# Altium schematic sheet [SH][SW1] V1.0.SchDoc
size A3; PageSetup: Record=PageOptions|CenterHorizontal=True|CenterVertical=True|PrintScale=0.91|XCorrection=1.00|YCorrection=1.00|PrintKind=1|BorderSize=5000000|LeftOffset=0|BottomOffset=0|Orientation=2|PaperLength=3530|PaperWidth=2500|Scale=100|PaperSource=7|PrintQuality=1200|MediaType=1|DitherType=10|PrintScaleMode=1|PaperKind=B4 (ISO)|PaperIndex=42
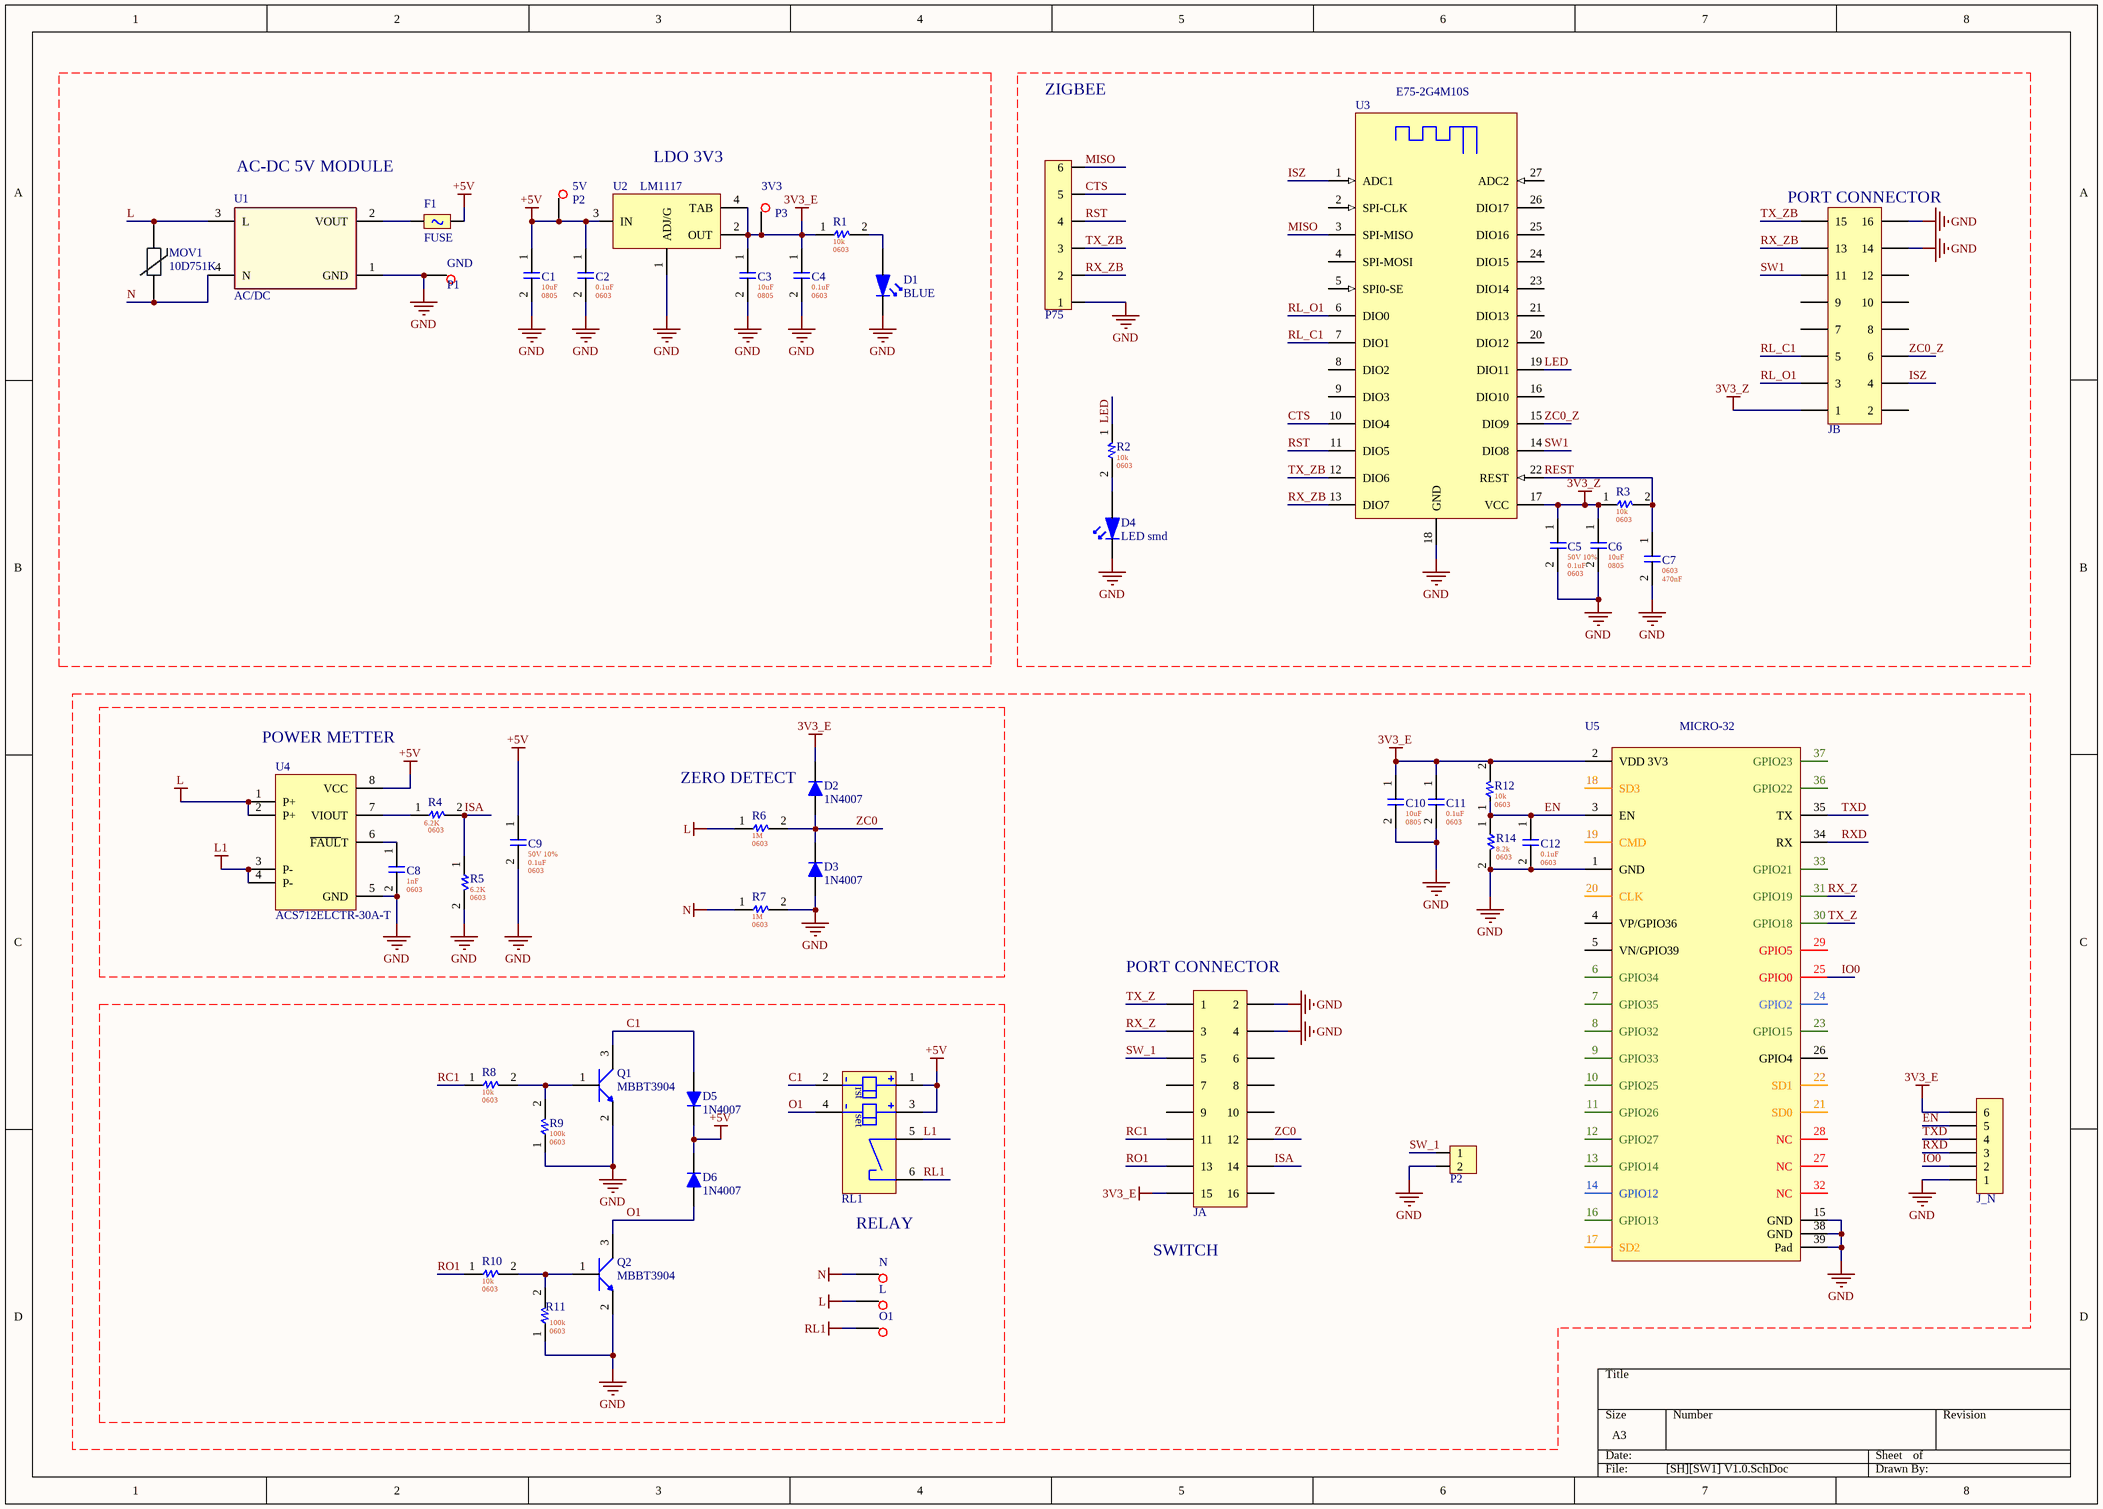
[diagram p0: [SH][SW1] V1.0.SchDoc]

## Parts
3V3  P3  [TEXT_POINT]
5V  P2  [TEXT_POINT]
C1  FP: 0805  [0805 C]  (hidden comment: 10uF)
C2  FP: 0603  [0603 C]  (hidden comment: 0.1uF)
C3  FP: 0805  [0805 C]  (hidden comment: 10uF)
C4  FP: 0603  [0603 C]  (hidden comment: 0.1uF)
C5  VOLTAGE + TOLE: 50V 10%  FP: 0603  [0603 C]  (hidden comment: 0.1uF)
C6  FP: 0805  [0805 C]  (hidden comment: 10uF)
C7  FP: 0603  [0603 C]  (hidden comment: 470nF)
C8  FP: 0603  [0603 C]  (hidden comment: 1nF)
C9  VOLTAGE + TOLE: 50V 10%  FP: 0603  [0603 C]  (hidden comment: 0.1uF)
C10  FP: 0805  [0805 C]  (hidden comment: 10uF)
C11  FP: 0603  [0603 C]  (hidden comment: 0.1uF)
C12  FP: 0603  [0603 C]  (hidden comment: 0.1uF)
D1  BLUE  [Led 1206]
D2  1N4007  [SOD-123]
D3  1N4007  [SOD-123]
D4  LED smd  [Led 1206]
D5  1N4007  [SOD-123]
D6  1N4007  [SOD-123]
F1  FUSE  [1812]
GND  P1  [TEXT_POINT]
J_N  P6  [P6 - 1.27MM]  (value not drawn)
JA  rao doi  [P2X8 - 2.0mm - female - SMD]  (value not drawn)
JB  rao doi  [P2X8 - 2.0mm - SMD]  (value not drawn)
L  P1  [P1 - BRASS TERMINAL]  (value not drawn)
MOV1  10D751K  [MOV]
N  P1  [P1 - BRASS TERMINAL]  (value not drawn)
O1  P1  [P1 - BRASS TERMINAL]  (value not drawn)
P2  P2  [P2 - 2.54mm]  (value not drawn)
P75  P6  [P6 - 1.27MM]  (value not drawn)
Q1  MBBT3904  [SOT 23-3]
Q2  MBBT3904  [SOT 23-3]
R1  FP: 0603  [0603 R]  (hidden comment: 10k)
R2  FP: 0603  [0603 R]  (hidden comment: 10k)
R3  FP: 0603  [0603 R]  (hidden comment: 10k)
R4  value 6.2K  FP: 0603  [0603 R]  (hidden comment: 8.2k)
R5  value 6.2K  FP: 0603  [0603 R]  (hidden comment: 8.2k)
R6  FP: 0603  [0603 R]  (hidden comment: 1M)
R7  FP: 0603  [0603 R]  (hidden comment: 1M)
R8  FP: 0603  [0603 R]  (hidden comment: 10K)
R9  FP: 0603  [0603 R]  (hidden comment: 100k)
R10  FP: 0603  [0603 R]  (hidden comment: 10K)
R11  FP: 0603  [0603 R]  (hidden comment: 100k)
R12  FP: 0603  [0603 R]  (hidden comment: 10k)
R14  FP: 0603  [0603 R]  (hidden comment: 8.2k)
RL1  RELAY CHOT  [HFE60]  (value not drawn)
U1  AC/DC  [AC-DC 5V K4H24]
U2  LM1117  [SOT23-4]
U3  E75-2G4M10S  [ebyte - E75-2G4M10S]
U4  ACS712ELCTR-30A-T  [SOIC 8]
U5  MICRO-32  [ESP MICRO 32]

## Nets
3V3_E: 3V3.1(P) C3.1 C4.1 C10.1 C11.1 D2.2 J_N.6 JA.15 R1.1 R12.2 U2.2(OUT) U2.4(TAB) U5.2(VDD_3V3)
3V3_Z: C5.1 C6.1 JB.1 R3.1 U3.17(VCC)
+5V: 5V.1(P) C1.1 C2.1 C9.1 D5.2 D6.2 F1.2 RL1.1 RL1.3 U2.3(IN) U4.8(VCC)
GND: C1.2 C2.2 C3.2 C4.2 C5.2 C6.2 C7.2 C8.2 C9.2 C10.2 C11.2 C12.2 D1.2 D3.1 D4.2 GND.1(P) J_N.1 JA.2 JA.4 JB.14 JB.16 P2.2 P75.1 Q1.2(E) Q2.2(E) R5.2 R7.2 R9.1 R11.1 R14.2 U1.1(GND) U2.1(ADJ/G) U3.18(GND) U4.5(GND) U5.1(GND) U5.15(GND) U5.38(GND) U5.39(Pad)
L: L.1(P) MOV1.2 R6.1 U1.3(L) U4.1(P+) U4.2(P+)
L1: RL1.5 U4.3(P-) U4.4(P-)
N: MOV1.1 N.1(P) R7.1 U1.4(N)
RL1: O1.1(P) RL1.6
C1: D5.1 Q1.3(C) RL1.2
CTS: P75.5 U3.10(DIO4)
EN: C12.1 J_N.5 R12.1 R14.1 U5.3(EN)
IO0: J_N.2 U5.25(GPIO0)
ISA: JA.14 R4.2 R5.1
ISZ: JB.4 U3.1(ADC1)
LED: R2.1 U3.19(DIO11)
MISO: P75.6 U3.3(SPI-MISO)
O1: D6.1 Q2.3(C) RL1.4
RC1: JA.11 R8.1
REST: C7.1 R3.2 U3.22(REST)
RL_C1: JB.5 U3.7(DIO1)
RL_O1: JB.3 U3.6(DIO0)
RO1: JA.13 R10.1
RST: P75.4 U3.11(DIO5)
RX_Z: JA.3 U5.31(GPIO19)
RX_ZB: JB.13 P75.2 U3.13(DIO7)
RXD: J_N.3 U5.34(RX)
SW1: JB.11 U3.14(DIO8)
SW_1: JA.5 P2.1
TX_Z: JA.1 U5.30(GPIO18)
TX_ZB: JB.15 P75.3 U3.12(DIO6)
TXD: J_N.4 U5.35(TX)
ZC0: D2.1 D3.2 JA.12 R6.2
ZC0_Z: JB.6 U3.15(DIO9)
NetC8_1: C8.1 U4.6(~{FAUL}T)
NetD1_1: D1.1 R1.2
NetD4_1: D4.1 R2.2
NetF1_1: F1.1 U1.2(VOUT)
NetQ1_1: Q1.1(B) R8.2 R9.2
NetQ2_1: Q2.1(B) R10.2 R11.2
NetR4_1: R4.1 U4.7(VIOUT)

Not connected (* = marked no-connect by the designer): JA 6 7 8 9 10 16; JB 2 7 8 9 10 12; U3 2(SPI-CLK) 4(SPI-MOSI) 5(SPI0-SE) 8(DIO2) 9(DIO3) 16(DIO10) 20(DIO12) 21(DIO13) 23(DIO14) 24(DIO15) 25(DIO16) 26(DIO17) 27(ADC2); U5 4(VP/GPIO36) 5(VN/GPIO39) 6(GPIO34) 7(GPIO35) 8(GPIO32) 9(GPIO33) 10(GPIO25) 11(GPIO26) 12(GPIO27) 13(GPIO14) 14(GPIO12) 16(GPIO13) 17(SD2) 18(SD3) 19(CMD) 20(CLK) 21(SD0) 22(SD1) 23(GPIO15) 24(GPIO2) 26(GPIO4) 27(NC) 28(NC) 29(GPIO5) 32(NC) 33(GPIO21) 36(GPIO22) 37(GPIO23)

## Notes on the sheet
- ZIGBEE
- (near U1) AC-DC 5V MODULE
- (near U2) LDO 3V3
- (near JB) PORT CONNECTOR
- (near U4) POWER METTER
- ZERO DETECT
- (near JA) PORT CONNECTOR
- RELAY
- (near JA) SWITCH
- (in symbol RELAY CHOT) rst; set

## Library data of the parts
3V3 5V = P1
C1 C3 C6 C10 = 0805 10uF CER: CAP CER 10uF 50V 10% 0805 SMD; VOLTAGE + TOLE: 50V 10%; PACKAGE: SMD; DATE: 04-Mar-21; CREATOR: MMUOP; ComponentLink1Description: New link; ComponentLink1URL: *; VALUE: 10uF
C2 C4 C11 C12 = 0603 0.1uF CER: CAP CER 0.1uF 50V 10% 0603 SMD; VOLTAGE + TOLE: 50V 10%; PACKAGE: SMD; DATE: 04-Mar-21; CREATOR: MMUOP; ComponentLink1Description: New link; ComponentLink1URL: *; VALUE: 0.1uF
C5 C9 = 0603 0.1uF CER: CAP CER 0.1uF 50V 10% 0603 SMD; PACKAGE: SMD; DATE: 04-Mar-21; CREATOR: MMUOP; ComponentLink1Description: New link; ComponentLink1URL: *; VALUE: 0.1uF
C7 = 0603 470nF CER: CAP CER 470nF 50V 10% 0603 SMD; VOLTAGE + TOLE: 50V 10%; PACKAGE: SMD; DATE: 04-Mar-21; CREATOR: MMUOP; ComponentLink1Description: New link; ComponentLink1URL: *; VALUE: 470nF
C8 = 0603 1nF CER: CAP CER 1nF 50V 10% 0603 SMD; VOLTAGE + TOLE: 50V 10%; PACKAGE: SMD; DATE: 04-Mar-21; CREATOR: MMUOP; ComponentLink1Description: New link; ComponentLink1URL: *; VALUE: 1nF
D1 = LED smd
D2 D3 D5 D6 = Diode schottky: PN: *
JA JB = P2x8
MOV1 = VARISTOR: 750V
Q1 Q2 = TRANS NPN: Bipolar (BJT) Transistor NPN 40 V 200 mA 300MHz 350 mW Surface Mount SOT-23-3 (TO-236)
R1-R3 R12 = 0603 10k 1%: 10k 1% 0603 SMD; PN: C98220; PACKAGE: SMD; DATE: 04-Mar-21; CREATOR: MMUOP; ComponentLink1Description: New link; ComponentLink1URL: *; VOLTAGE + TOLE: 1%; VALUE: 10k
R4 R5 R14 = 0603 8.2k 1%: 8.2k 1% 0603 SMD; PACKAGE: SMD; DATE: 04-Mar-21; CREATOR: MMUOP; ComponentLink1Description: New link; ComponentLink1URL: *; VOLTAGE + TOLE: 1%
  R14: VALUE: 8.2k
R6 R7 = 0603 1M 1%: 1M 1% 0603 SMD; PACKAGE: SMD; DATE: 04-Mar-21; CREATOR: MMUOP; ComponentLink1Description: New link; ComponentLink1URL: *; VOLTAGE + TOLE: 1%; VALUE: 1M
R8 R10 = 0603 10K 1%: 10k 1% 0603 SMD; PACKAGE: SMD; DATE: 04-Mar-21; CREATOR: MMUOP; ComponentLink1Description: New link; ComponentLink1URL: *; VOLTAGE + TOLE: 1%; VALUE: 10k
R9 R11 = 0603 100K 1%: 100k 1% 0603 SMD; PACKAGE: SMD; DATE: 04-Mar-21; CREATOR: MMUOP; ComponentLink1Description: New link; ComponentLink1URL: *; VOLTAGE + TOLE: 1%; VALUE: 100k
U3 = ebyte - E75-2G4M10S
U4 = ACS71240: ACS712ELCTR-20A  SOIC 8; ComponentLink1Description: New link; ComponentLink1URL: https://banlinhkiendientu.vn/acs712t/
U5 = ESP MICRO-32_FIX